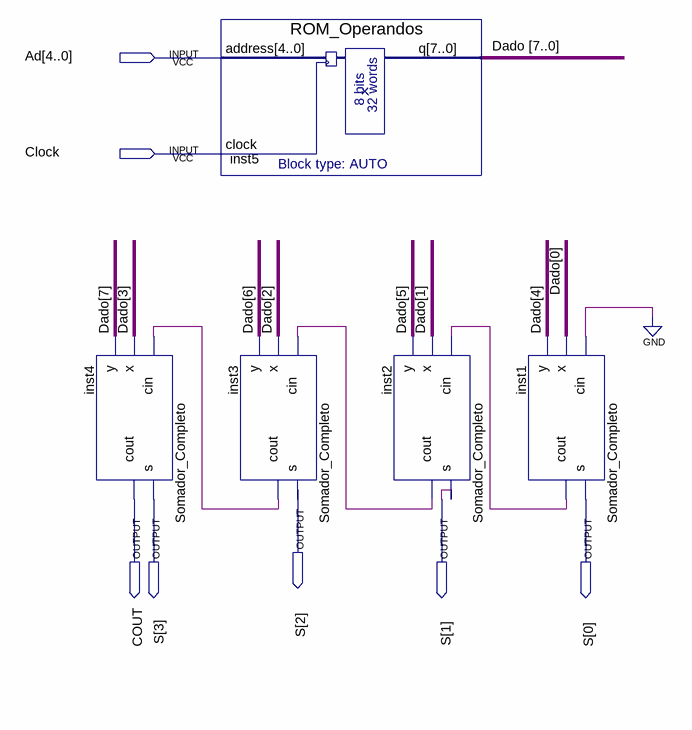
[diagram p0: schematic sheet]
// Quartus schematic Somador_Completo_4bits.bdf as structural Verilog: 5 symbols, 7 pins
module Somador_Completo_4bits (
  input  [4:0] Ad,
  input  Clock,
  output [3:0] S,
  output COUT
);

  wire inst1_cout, inst2_cout, inst3_cout;
  wire [7:0] Dado;

  Somador_Completo inst4 (.cin(inst3_cout), .x(Dado[3]), .y(Dado[7]), .s(S[3]), .cout(COUT));
  ROM_Operandos inst5 (.address(Ad), .clock(Clock), .q(Dado));
  Somador_Completo inst3 (.cin(inst2_cout), .x(Dado[2]), .y(Dado[6]), .s(S[2]), .cout(inst3_cout));
  Somador_Completo inst2 (.cin(inst1_cout), .x(Dado[1]), .y(Dado[5]), .s(S[1]), .cout(inst2_cout));
  Somador_Completo inst1 (.cin(1'b0), .x(Dado[0]), .y(Dado[4]), .s(S[0]), .cout(inst1_cout));
endmodule
